# EAGLE schematic Circuit (EAGLE 8.5.0)
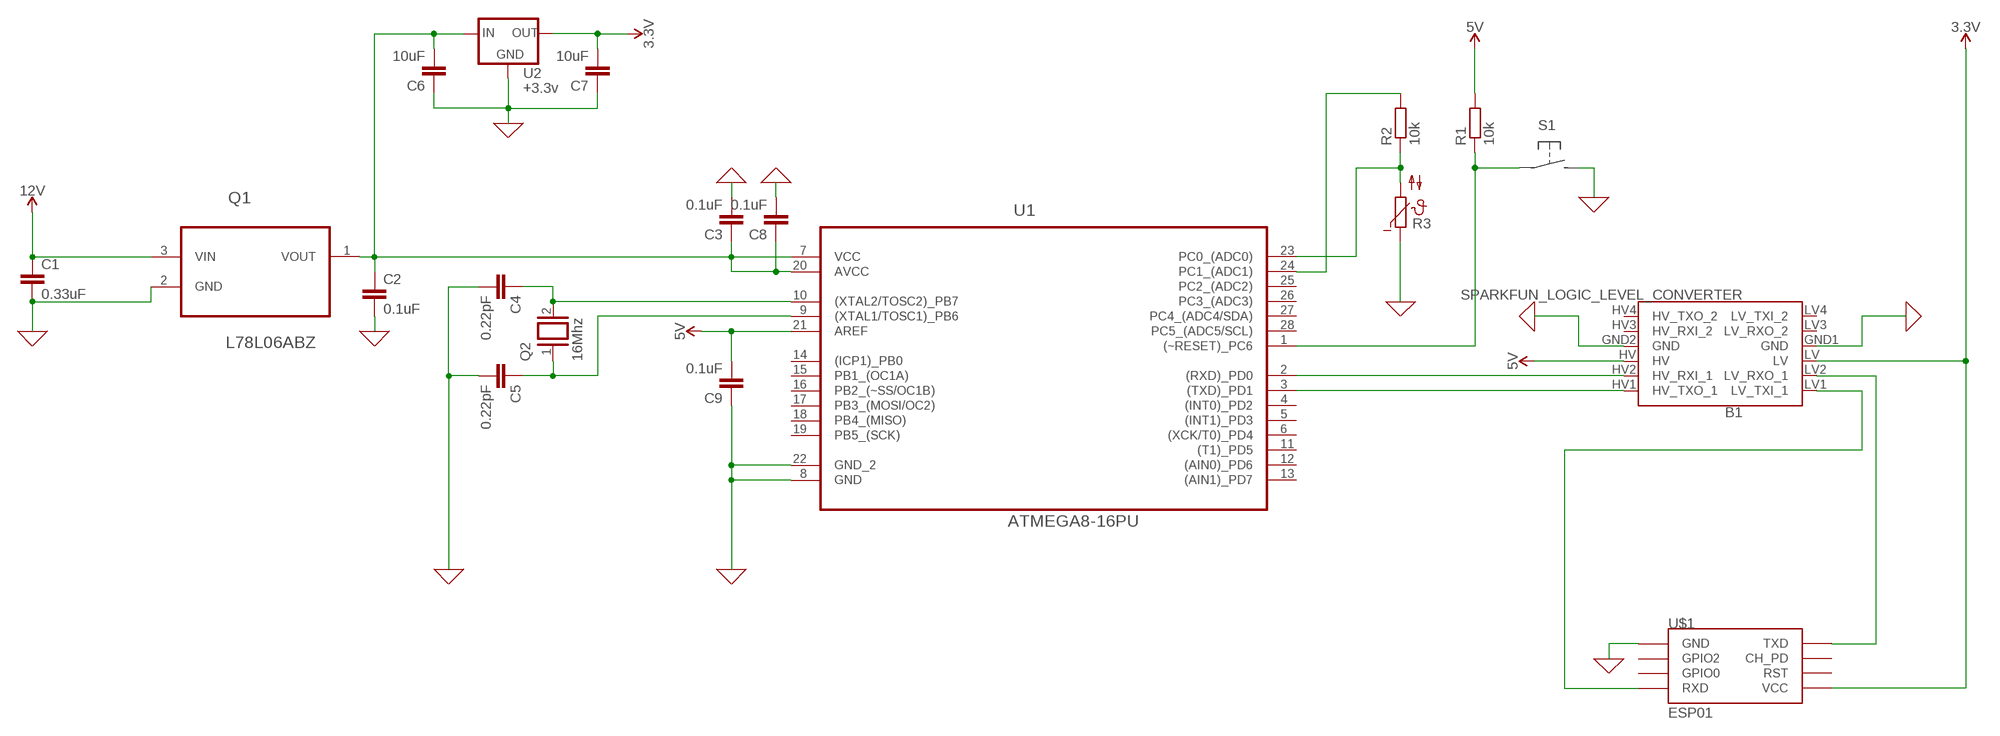
[diagram p0: schematic, sheet 1]

## Parts
B1  SPARKFUN_LOGIC_LEVEL_CONVERTER  [SPARKFUN_LOGIC_LEVEL_CONVERTER]
C1  0.33uF  C-EU050-025X075  [C050-025X075]
C2  0.1uF  C-EU050-025X075  [C050-025X075]
C3  0.1uF  C-EU050-025X075  [C050-025X075]
C4  0.22pF  C-EU050-025X075  [C050-025X075]
C5  0.22pF  C-EU050-025X075  [C050-025X075]
C6  10uF  C-EU050-025X075  [C050-025X075]
C7  10uF  C-EU050-025X075  [C050-025X075]
C8  0.1uF  C-EU050-025X075  [C050-025X075]
C9  0.1uF  C-EU050-025X075  [C050-025X075]
Q1  L78L06ABZ  [TO127P254X749-3]
Q2  16Mhz  XTAL  [Q]
R1  10k  R-EU_VTA56  [VTA56]
R2  10k  R-EU_VTA56  [VTA56]
R3  NTC640  [P640]
U1  ATMEGA8-16PU  [DIP254P762X457-28]
U2  +3.3v  V_REG_78XX7812  [TO-252]
U$1  ESP01  [ESP01]

## Nets
0: B1.GND1(GND) B1.GND2(GND) C1.2 C2.2 C3.2 C4.2 C5.2 C6.1 C7.1 C8.2 C9.1 Q1.2(GND) R3.1 U1.8(GND) U1.22(GND_2) U2.3(GND) U$1.GND ; supply symbol labelled GND
3.3V: B1.LV C7.2 U2.2(OUT) U$1.VCC
5V: B1.HV C9.2 R1.2 U1.21(AREF)
12V: C1.1 Q1.3(VIN)
N$1: C2.1 C3.1 C6.2 C8.1 Q1.1(VOUT) U1.7(VCC) U1.20(AVCC) U2.1(IN)
N$2: R1.1 U1.1((~RESET)_PC6)
N$3: C4.1 Q2.2 U1.10((XTAL2/TOSC2)_PB7)
N$4: B1.HV2(HV_RXI_1) U1.2((RXD)_PD0)
N$5: B1.HV1(HV_TXO_1) U1.3((TXD)_PD1)
N$6: B1.LV2(LV_RXO_1) U$1.TX(TXD)
N$7: C5.1 Q2.1 U1.9((XTAL1/TOSC1)_PB6)
N$8: B1.LV1(LV_TXI_1) U$1.RX(RXD)
N$9: R2.1 R3.2 U1.23(PC0_(ADC0))
N$10: R2.2 U1.24(PC1_(ADC1))
Unconnected: B1.HV3(HV_RXI_2) B1.HV4(HV_TXO_2) B1.LV3(LV_RXO_2) B1.LV4(LV_TXI_2) U1.4((INT0)_PD2) U1.5((INT1)_PD3) U1.6((XCK/T0)_PD4) U1.11((T1)_PD5) U1.12((AIN0)_PD6) U1.13((AIN1)_PD7) U1.14((ICP1)_PB0) U1.15(PB1_(OC1A)) U1.16(PB2_(~SS/OC1B)) U1.17(PB3_(MOSI/OC2)) U1.18(PB4_(MISO)) U1.19(PB5_(SCK)) U1.25(PC2_(ADC2)) U1.26(PC3_(ADC3)) U1.27(PC4_(ADC4/SDA)) U1.28(PC5_(ADC5/SCL)) U$1.CH_PD U$1.GPIO0 U$1.GPIO2 U$1.RST

## Library data of the parts
B1 = SparkFun-Boards:SPARKFUN_LOGIC_LEVEL_CONVERTER: SparkFun Logic Level Converter -Bi-Directional This is the mechnical outline for the 3.3V - 5V bi directional logic level converter. *Note, the "LOCK" Package has the header pins staggered by an offset of 5 mils (off center line), so that when you slide a row of standard 0.1" headers into the PTH pads, it will hold position vertically. See the follwing turorial for more information on this type of special footprints: Sneaky Footprints <https://www.sparkfun.com/tutorials/114> SparkFun Products: SparkFun Logic Level Converter - Bi-Directional <https://www.sparkfun.com/products/12009>
C1-C9 = resistor:C-EU: CAPACITOR, European symbol
Q1 = ST Microelctronics_By_element14_Batch_1:L78L06ABZ: Positive voltage regulators; MPN: L78L06ABZ; OC_FARNELL: 1467764; OC_NEWARK: 89K1345; PACKAGE: TO-92; SUPPLIER: STMICROELECTRONICS
Q2 = special:XTAL: CRYSTAL
R1 R2 = rcl:R-EU_: RESISTOR, European symbol; SPICEPREFIX: R
R3 = ptc-ntc:NTC640: PHILIPS NTC; OC_FARNELL: unknown; OC_NEWARK: unknown
U1 = Atmel_By_element14_Batch_1-00:ATMEGA8-16PU: Programmable Flash; DESCRIPTION: Programmable Flash; MPN: ATMEGA8-16PU; OC_FARNELL: 9171380; OC_NEWARK: 01M6901; PACKAGE: PCDIP-28; SUPPLIER: ATMEL
U2 = SparkFun-IC-Power:V_REG_78XX: Voltage Regulator Standard 78xx regulator. IGO (Input Ground Output). Spark Fun Electronics SKU : COM-00107; PROD_ID: VREG-12370; VALUE: +12v
U$1 = esp8266modules:ESP01: ESP8266 Wifi module 01